# Altium schematic sheet 0.CONNECTOR.SchDoc
size A2
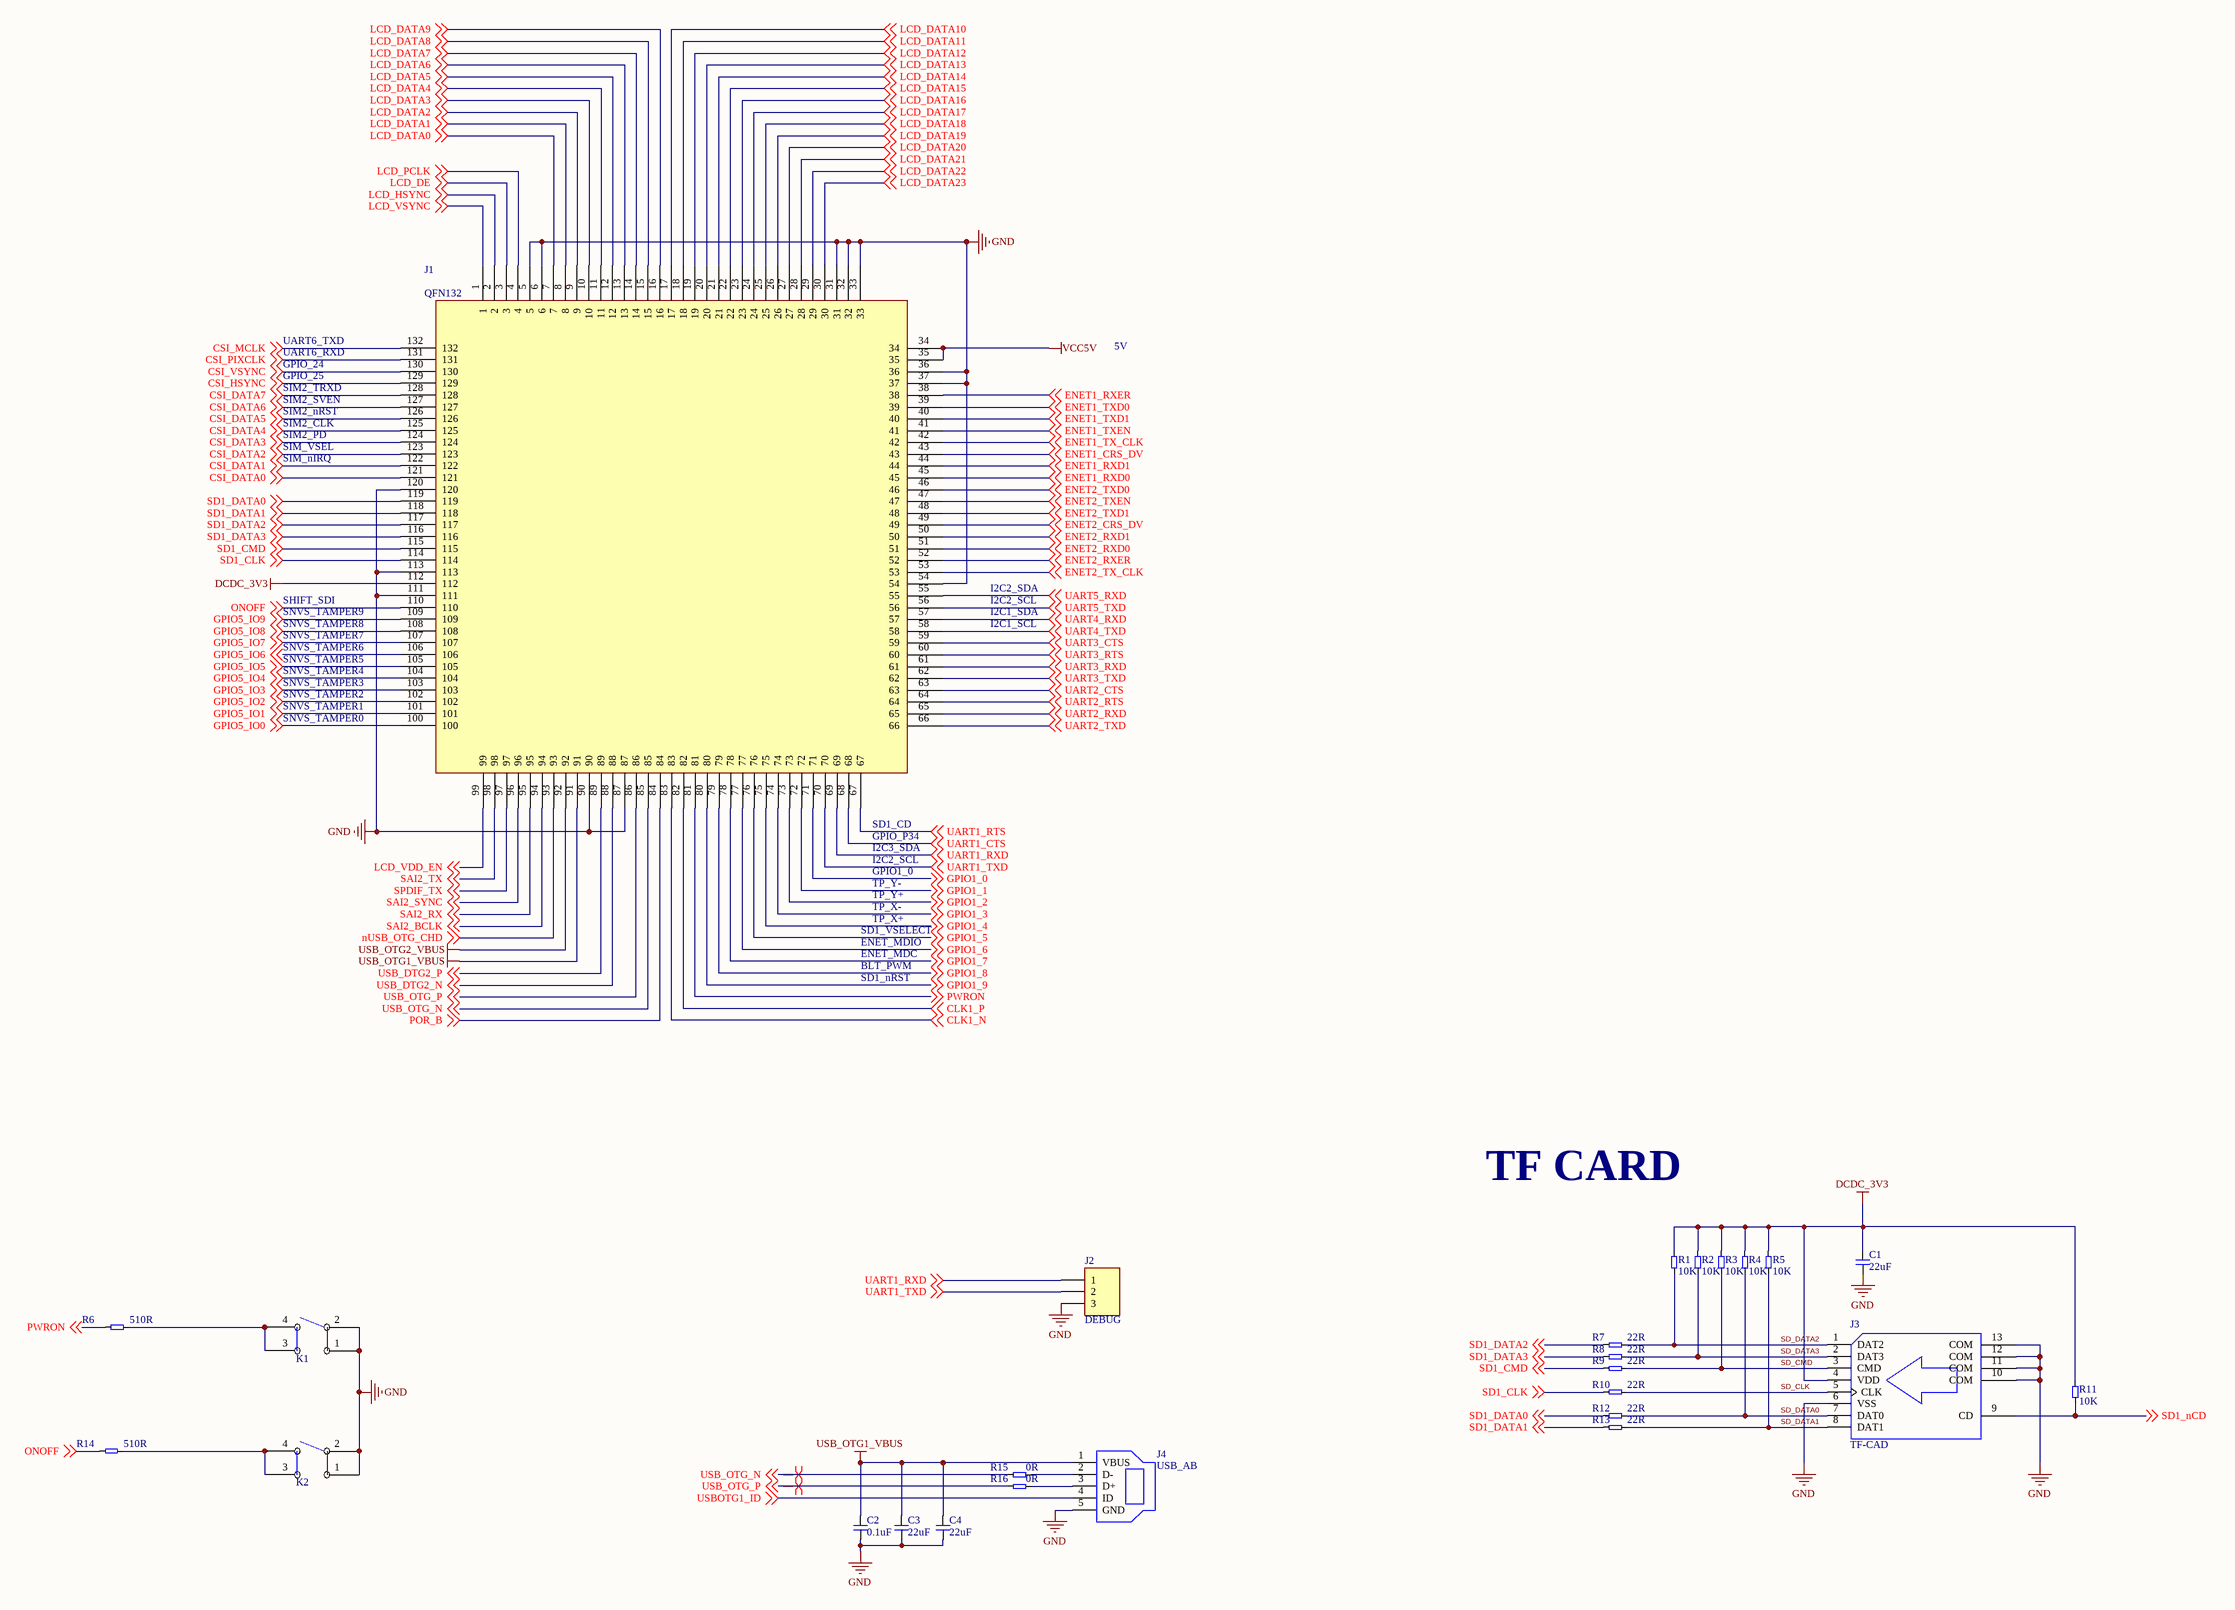
[diagram p0: 0.CONNECTOR.SchDoc]

## Parts
C1  22uF  [0805C]
C2  0.1uF  [0603C]
C3  22uF  [0805C]
C4  22uF  [0805C]
J1  QFN132  [QFN132]
J2  DEBUG  [HDR1X3]
J3  TF-CAD  [TF-CARD]
J4  USB_AB  [MINI USB B]
K1  按键  [SS-SPB-4.5]  (value not drawn)
K2  按键  [SS-SPB-4.5]  (value not drawn)
R1  10K  [0603R]
R2  10K  [0603R]
R3  10K  [0603R]
R4  10K  [0603R]
R5  10K  [0603R]
R6  510R  [0603R]
R7  22R  [0603R]
R8  22R  [0603R]
R9  22R  [0603R]
R10  22R  [0603R]
R11  10K  [0603R]
R12  22R  [0603R]
R13  22R  [0603R]
R14  510R  [0603R]
R15  0R  [0603R]
R16  0R  [0603R]

## Nets
DCDC_3V3: C1.2 J1.112 J3.4(VDD) R1.2 R2.2 R3.2 R4.2 R5.2 R11.2
EARTH: J4.6(9) J4.7(9) J4.8(9) J4.9
GND: C1.1 C2.1 C3.1 C4.1 J1.5 J1.6 J1.31 J1.32 J1.33 J1.36 J1.37 J1.54 J1.87 J1.90 J1.111 J1.113 J1.120 J2.3 J3.6(VSS) J3.10(COM) J3.11(COM) J3.12(COM) J3.13(COM) J4.5(GND) K1.1 K1.2 K2.1 K2.2
USB_OTG1_VBUS: C2.2 C3.2 C4.2 J1.91 J4.1(VBUS)
USB_OTG2_VBUS: J1.92
VCC5V: J1.34 J1.35
CLK1_N: J1.83 ; off-sheet CLK1_N
CLK1_P: J1.82 ; off-sheet CLK1_P
CSI_DATA0: J1.121 ; off-sheet CSI_DATA0
CSI_DATA1: J1.122 ; off-sheet CSI_DATA1
CSI_DATA2: J1.123 ; off-sheet CSI_DATA2
CSI_DATA3: J1.124 ; off-sheet CSI_DATA3
CSI_DATA4: J1.125 ; off-sheet CSI_DATA4
CSI_DATA5: J1.126 ; off-sheet CSI_DATA5
CSI_DATA6: J1.127 ; off-sheet CSI_DATA6
CSI_DATA7: J1.128 ; off-sheet CSI_DATA7
CSI_HSYNC: J1.129 ; off-sheet CSI_HSYNC
CSI_MCLK: J1.132 ; off-sheet CSI_MCLK
CSI_PIXCLK: J1.131 ; off-sheet CSI_PIXCLK
CSI_VSYNC: J1.130 ; off-sheet CSI_VSYNC
ENET1_CRS_DV: J1.43 ; off-sheet ENET1_CRS_DV
ENET1_RXD0: J1.45 ; off-sheet ENET1_RXD0
ENET1_RXD1: J1.44 ; off-sheet ENET1_RXD1
ENET1_RXER: J1.38 ; off-sheet ENET1_RXER
ENET1_TX_CLK: J1.42 ; off-sheet ENET1_TX_CLK
ENET1_TXD0: J1.39 ; off-sheet ENET1_TXD0
ENET1_TXD1: J1.40 ; off-sheet ENET1_TXD1
ENET1_TXEN: J1.41 ; off-sheet ENET1_TXEN
ENET2_CRS_DV: J1.49 ; off-sheet ENET2_CRS_DV
ENET2_RXD0: J1.51 ; off-sheet ENET2_RXD0
ENET2_RXD1: J1.50 ; off-sheet ENET2_RXD1
ENET2_RXER: J1.52 ; off-sheet ENET2_RXER
ENET2_TX_CLK: J1.53 ; off-sheet ENET2_TX_CLK
ENET2_TXD0: J1.46 ; off-sheet ENET2_TXD0
ENET2_TXD1: J1.48 ; off-sheet ENET2_TXD1
ENET2_TXEN: J1.47 ; off-sheet ENET2_TXEN
GPIO1_0: J1.71 ; off-sheet GPIO1_0
GPIO1_1: J1.72 ; off-sheet GPIO1_1
GPIO1_2: J1.73 ; off-sheet GPIO1_2
GPIO1_3: J1.74 ; off-sheet GPIO1_3
GPIO1_4: J1.75 ; off-sheet GPIO1_4
GPIO1_5: J1.76 ; off-sheet GPIO1_5
GPIO1_6: J1.77 ; off-sheet GPIO1_6
GPIO1_7: J1.78 ; off-sheet GPIO1_7
GPIO1_8: J1.79 ; off-sheet GPIO1_8
GPIO1_9: J1.80 ; off-sheet GPIO1_9
GPIO5_IO0: J1.100 ; off-sheet GPIO5_IO0
GPIO5_IO1: J1.101 ; off-sheet GPIO5_IO1
GPIO5_IO2: J1.102 ; off-sheet GPIO5_IO2
GPIO5_IO3: J1.103 ; off-sheet GPIO5_IO3
GPIO5_IO4: J1.104 ; off-sheet GPIO5_IO4
GPIO5_IO5: J1.105 ; off-sheet GPIO5_IO5
GPIO5_IO6: J1.106 ; off-sheet GPIO5_IO6
GPIO5_IO7: J1.107 ; off-sheet GPIO5_IO7
GPIO5_IO8: J1.108 ; off-sheet GPIO5_IO8
GPIO5_IO9: J1.109 ; off-sheet GPIO5_IO9
LCD_DATA0: J1.7 ; off-sheet LCD_DATA0
LCD_DATA1: J1.8 ; off-sheet LCD_DATA1
LCD_DATA2: J1.9 ; off-sheet LCD_DATA2
LCD_DATA3: J1.10 ; off-sheet LCD_DATA3
LCD_DATA4: J1.11 ; off-sheet LCD_DATA4
LCD_DATA5: J1.12 ; off-sheet LCD_DATA5
LCD_DATA6: J1.13 ; off-sheet LCD_DATA6
LCD_DATA7: J1.14 ; off-sheet LCD_DATA7
LCD_DATA8: J1.15 ; off-sheet LCD_DATA8
LCD_DATA9: J1.16 ; off-sheet LCD_DATA9
LCD_DATA10: J1.17 ; off-sheet LCD_DATA10
LCD_DATA11: J1.18 ; off-sheet LCD_DATA11
LCD_DATA12: J1.19 ; off-sheet LCD_DATA12
LCD_DATA13: J1.20 ; off-sheet LCD_DATA13
LCD_DATA14: J1.21 ; off-sheet LCD_DATA14
LCD_DATA15: J1.22 ; off-sheet LCD_DATA15
LCD_DATA16: J1.23 ; off-sheet LCD_DATA16
LCD_DATA17: J1.24 ; off-sheet LCD_DATA17
LCD_DATA18: J1.25 ; off-sheet LCD_DATA18
LCD_DATA19: J1.26 ; off-sheet LCD_DATA19
LCD_DATA20: J1.27 ; off-sheet LCD_DATA20
LCD_DATA21: J1.28 ; off-sheet LCD_DATA21
LCD_DATA22: J1.29 ; off-sheet LCD_DATA22
LCD_DATA23: J1.30 ; off-sheet LCD_DATA23
LCD_DE: J1.3 ; off-sheet LCD_DE
LCD_HSYNC: J1.2 ; off-sheet LCD_HSYNC
LCD_PCLK: J1.4 ; off-sheet LCD_PCLK
LCD_VDD_EN: J1.99 ; off-sheet LCD_VDD_EN
LCD_VSYNC: J1.1 ; off-sheet LCD_VSYNC
nUSB_OTG_CHD: J1.93 ; off-sheet nUSB_OTG_CHD
ONOFF: J1.110 R14.2 ; off-sheet ONOFF
POR_B: J1.84 ; off-sheet POR_B
PWRON: J1.81 R6.2 ; off-sheet PWRON
SAI2_BCLK: J1.94 ; off-sheet SAI2_BCLK
SAI2_RX: J1.95 ; off-sheet SAI2_RX
SAI2_SYNC: J1.96 ; off-sheet SAI2_SYNC
SAI2_TX: J1.98 ; off-sheet SAI2_TX
SD1_CLK: J1.114 R10.1 ; off-sheet SD1_CLK
SD1_CMD: J1.115 R9.1 ; off-sheet SD1_CMD
SD1_DATA0: J1.119 R12.1 ; off-sheet SD1_DATA0
SD1_DATA1: J1.118 R13.1 ; off-sheet SD1_DATA1
SD1_DATA2: J1.117 R7.1 ; off-sheet SD1_DATA2
SD1_DATA3: J1.116 R8.1 ; off-sheet SD1_DATA3
SD1_nCD: J3.9(CD) R11.1 ; off-sheet SD1_nCD
SD_CLK: J3.5(CLK) R10.2
SD_CMD: J3.3(CMD) R3.1 R9.2
SD_DATA0: J3.7(DAT0) R4.1 R12.2
SD_DATA1: J3.8(DAT1) R5.1 R13.2
SD_DATA2: J3.1(DAT2) R1.1 R7.2
SD_DATA3: J3.2(DAT3) R2.1 R8.2
SPDIF_TX: J1.97 ; off-sheet SPDIF_TX
UART1_CTS: J1.68 ; off-sheet UART1_CTS
UART1_RTS: J1.67 ; off-sheet UART1_RTS
UART1_RXD: J1.69 J2.1 ; off-sheet UART1_RXD
UART1_TXD: J1.70 J2.2 ; off-sheet UART1_TXD
UART2_CTS: J1.63 ; off-sheet UART2_CTS
UART2_RTS: J1.64 ; off-sheet UART2_RTS
UART2_RXD: J1.65 ; off-sheet UART2_RXD
UART2_TXD: J1.66 ; off-sheet UART2_TXD
UART3_CTS: J1.59 ; off-sheet UART3_CTS
UART3_RTS: J1.60 ; off-sheet UART3_RTS
UART3_RXD: J1.61 ; off-sheet UART3_RXD
UART3_TXD: J1.62 ; off-sheet UART3_TXD
UART4_RXD: J1.57 ; off-sheet UART4_RXD
UART4_TXD: J1.58 ; off-sheet UART4_TXD
UART5_RXD: J1.55 ; off-sheet UART5_RXD
UART5_TXD: J1.56 ; off-sheet UART5_TXD
USB_DTG2_N: J1.88 ; off-sheet USB_DTG2_N
USB_DTG2_P: J1.89 ; off-sheet USB_DTG2_P
USB_OTG_N: J1.85 R15.2 ; off-sheet USB_OTG_N
USB_OTG_P: J1.86 R16.2 ; off-sheet USB_OTG_P
USBOTG1_ID: J4.4(ID) ; off-sheet USBOTG1_ID
NetJ4_2: J4.2(D-) R15.1
NetJ4_3: J4.3(D+) R16.1
NetK1_3: K1.3 K1.4 R6.1
NetK2_3: K2.3 K2.4 R14.1

## Layout directives
differential pair: USB_OTG_N, USB_OTG_P

## Notes on the sheet
- UART6_TXD
- UART6_RXD
- GPIO_24
- GPIO_25
- SIM2_TRXD
- 5V
- SIM2_PD
- SIM2_CLK
- SIM2_nRST
- SIM2_SVEN
- SIM_nIRQ
- SIM_VSEL
- SNVS_TAMPER8
- SNVS_TAMPER9
- SHIFT_SDI
- I2C1_SCL
- I2C1_SDA
- I2C2_SCL
- I2C2_SDA
- SNVS_TAMPER4
- SNVS_TAMPER5
- SNVS_TAMPER7
- SNVS_TAMPER6
- SNVS_TAMPER0
- SNVS_TAMPER1
- SNVS_TAMPER2
- SNVS_TAMPER3
- I2C3_SDA
- SD1_CD
- GPIO_P34
- GPIO1_0
- TP_Y-
- TP_Y+
- TP_X-
- SD1_VSELECT
- ENET_MDIO
- ENET_MDC
- BLT_PWM
- SD1_nRST
- TP_X+
- TF CARD

## Library data of the parts
C1-C4 = 电容
J2 = Header 3: Header, 3-Pin; LatestRevisionDate: 17-Jul-2002; LatestRevisionNote: Re-released for DXP Platform.; Publisher: Altium Limited
J4 = USB_AB: 小USB插痤
R1-R16 = 电阻